# EAGLE schematic circuitdraft (EAGLE 9.5.1)
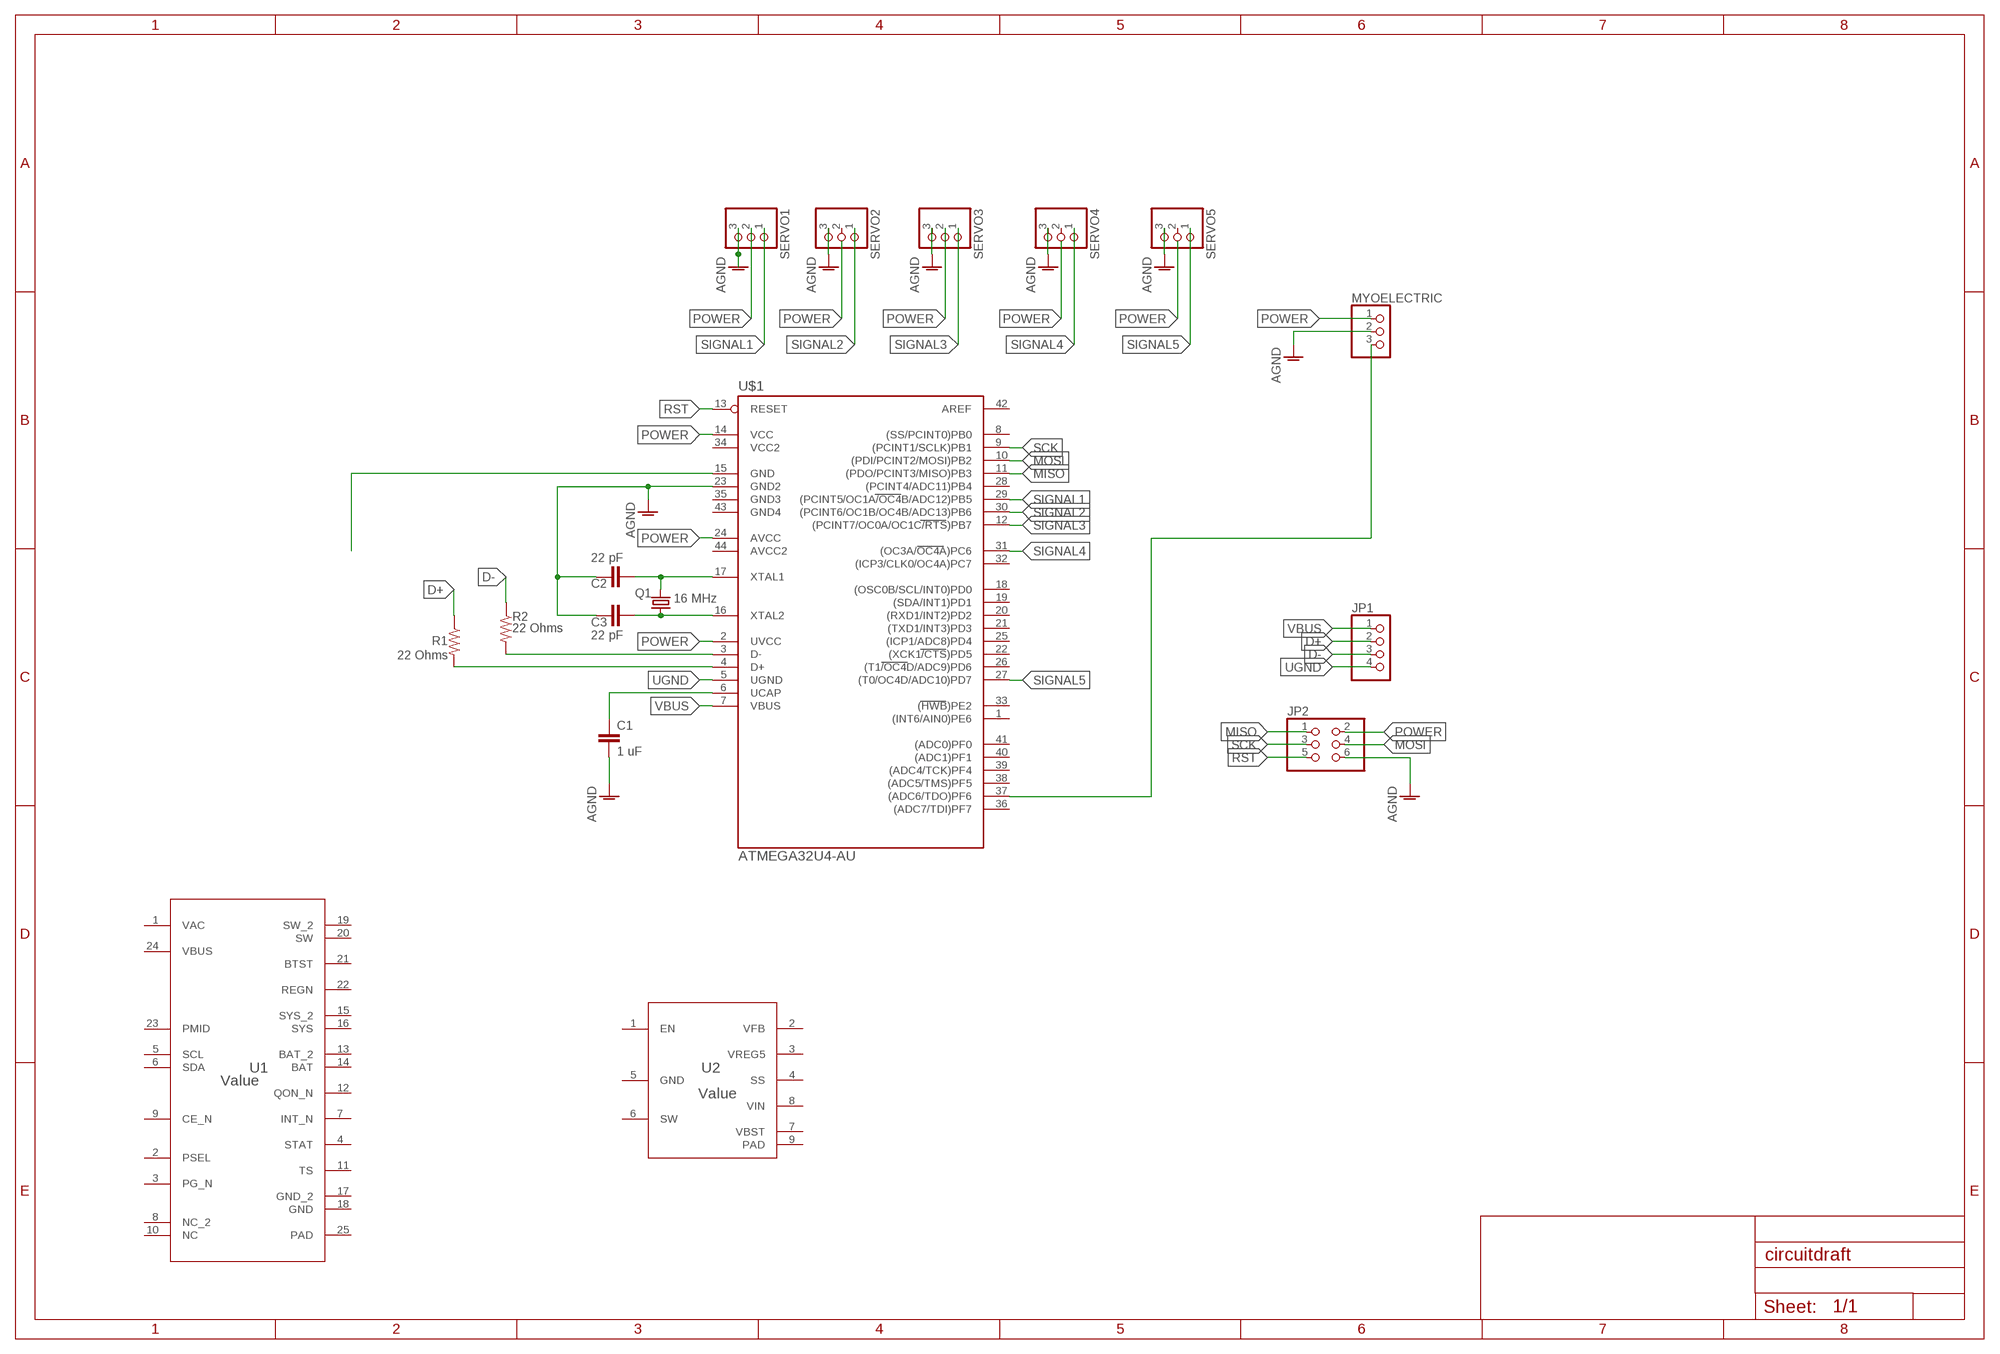
[diagram p0: schematic, sheet 1]

## Parts
C1  1 uF  C2,5-3  [C2.5-3]
C2  22 pF  C2,5-3  [C2.5-3]
C3  22 pF  C2,5-3  [C2.5-3]
JP1  PINHD-1X4  [1X04]
JP2  PINHD-2X3  [2X03]
MYOELECTRIC  PINHD-1X3  [1X03]
Q1  16 MHz  CRYSTALHC49S  [HC49/S]
R1  22 Ohms  R-US_0204/7  [0204/7]
R2  22 Ohms  R-US_0204/7  [0204/7]
SERVO1  PINHD-1X3  [1X03]
SERVO2  PINHD-1X3  [1X03]
SERVO3  PINHD-1X3  [1X03]
SERVO4  PINHD-1X3  [1X03]
SERVO5  PINHD-1X3  [1X03]
U1  Value  BQ25601RTWR  [RTW0024H]
U2  Value  UCC27211AQDDARQ1  [DDA0008E_N]
U$1  ATMEGA32U4-AU  [TQFP44]

## Nets
AGND: C1.2 C2.1 C3.1 JP2.6 MYOELECTRIC.2 SERVO1.3 SERVO2.3 SERVO3.3 SERVO4.3 SERVO5.3 U$1.23(GND2)
D+: JP1.2 R1.1
D-: JP1.3 R2.1
MISO: JP2.1 U$1.11((PDO/PCINT3/MISO)PB3)
MOSI: JP2.4 U$1.10((PDI/PCINT2/MOSI)PB2)
N$1: U$1.15(GND)
N$2: R2.2 U$1.3(D-)
N$3: MYOELECTRIC.3 U$1.37((ADC6/TDO)PF6)
N$4: R1.2 U$1.4(D+)
N$5: C3.2 Q1.1 U$1.16(XTAL2)
N$6: C2.2 Q1.2 U$1.17(XTAL1)
N$8: C1.1 U$1.6(UCAP)
POWER: JP2.2 MYOELECTRIC.1 SERVO1.2 SERVO3.2 U$1.2(UVCC) U$1.14(VCC) U$1.24(AVCC)
RST: JP2.5 U$1.13(RESET)
SCK: JP2.3 U$1.9((PCINT1/SCLK)PB1)
SIGNAL1: SERVO1.1 U$1.29((PCINT5/OC1A/OC4B/ADC12)PB5)
SIGNAL2: SERVO2.1 U$1.30((PCINT6/OC1B/OC4B/ADC13)PB6)
SIGNAL3: SERVO3.1 U$1.12((PCINT7/OC0A/OC1C/RTS)PB7)
SIGNAL4: SERVO4.1 U$1.31((OC3A/OC4A)PC6)
SIGNAL5: SERVO5.1 U$1.27((T0/OC4D/ADC10)PD7)
UGND: JP1.4 U$1.5(UGND)
VBUS: JP1.1 U$1.7(VBUS)
Unconnected: SERVO2.2 SERVO4.2 SERVO5.2 U1.2(PSEL) U1.3(PG_N) U1.4(STAT) U1.5(SCL) U1.6(SDA) U1.7(INT_N) U1.8(NC_2) U1.9(CE_N) U1.10(NC) U1.11(TS) U1.12(QON_N) U1.23(PMID) U1.24(VBUS) U2.3(VREG5) U2.5(GND) U2.6(SW) U2.8(VIN) U2.9(PAD) U$1.1((INT6/AIN0)PE6) U$1.8((SS/PCINT0)PB0) U$1.18((OSC0B/SCL/INT0)PD0) U$1.19((SDA/INT1)PD1) U$1.20((RXD1/INT2)PD2) U$1.21((TXD1/INT3)PD3) U$1.22((XCK1/CTS)PD5) U$1.25((ICP1/ADC8)PD4) U$1.26((T1/OC4D/ADC9)PD6) U$1.28((PCINT4/ADC11)PB4) U$1.32((ICP3/CLK0/OC4A)PC7) U$1.33((HWB)PE2) U$1.34(VCC2) U$1.35(GND3) U$1.36((ADC7/TDI)PF7) U$1.38((ADC5/TMS)PF5) U$1.39((ADC4/TCK)PF4) U$1.40((ADC1)PF1) U$1.41((ADC0)PF0) U$1.42(AREF) U$1.43(GND4) U$1.44(AVCC2)

## Power pins joined to a net without a drawn wire
BAT: U1.14(BAT)
BAT_2: U1.13(BAT_2)
BTST: U1.21(BTST)
EN: U2.1(EN)
GND: U1.18(GND)
GND_2: U1.17(GND_2)
PAD: U1.25(PAD)
REGN: U1.22(REGN)
SS: U2.4(SS)
SW: U1.20(SW)
SW_2: U1.19(SW_2)
SYS: U1.16(SYS)
SYS_2: U1.15(SYS_2)
VAC: U1.1(VAC)
VBST: U2.7(VBST)
VFB: U2.2(VFB)

## Library data of the parts
C1-C3 = capacitor-wima:C: CAPACITOR naming: grid - package width
JP1 = pinhead:PINHD-1X4: PIN HEADER
JP2 = pinhead:PINHD-2X3: PIN HEADER
MYOELECTRIC SERVO1-SERVO5 = pinhead:PINHD-1X3: PIN HEADER
Q1 = crystal:CRYSTAL: CRYSTAL; OC_FARNELL: 1667008; OC_NEWARK: unknown
R1 R2 = rcl:R-US_: RESISTOR, American symbol; SPICEPREFIX: R
U1 = charger:BQ25601RTWR: This might or might not work or might or might not be the correct part; MANUFACTURER: Texas Instruments; PARTNUMBER: BQ25601RTWR; REFDES: RefDes; TYPE: TYPE
U2 = powerPad:UCC27211AQDDARQ1: This is the PowerPad diagram for our voltage regulator using a different one; MANUFACTURER: Texas Instruments; PARTNUMBER: UCC27211AQDDARQ1; REFDES: RefDes; TYPE: TYPE
U$1 = mega32U4:ATMEGA32U4-AU